# EAGLE design MICS-4514_CO_and_NOx_Sensor_Breakout (EAGLE 6.5.0)
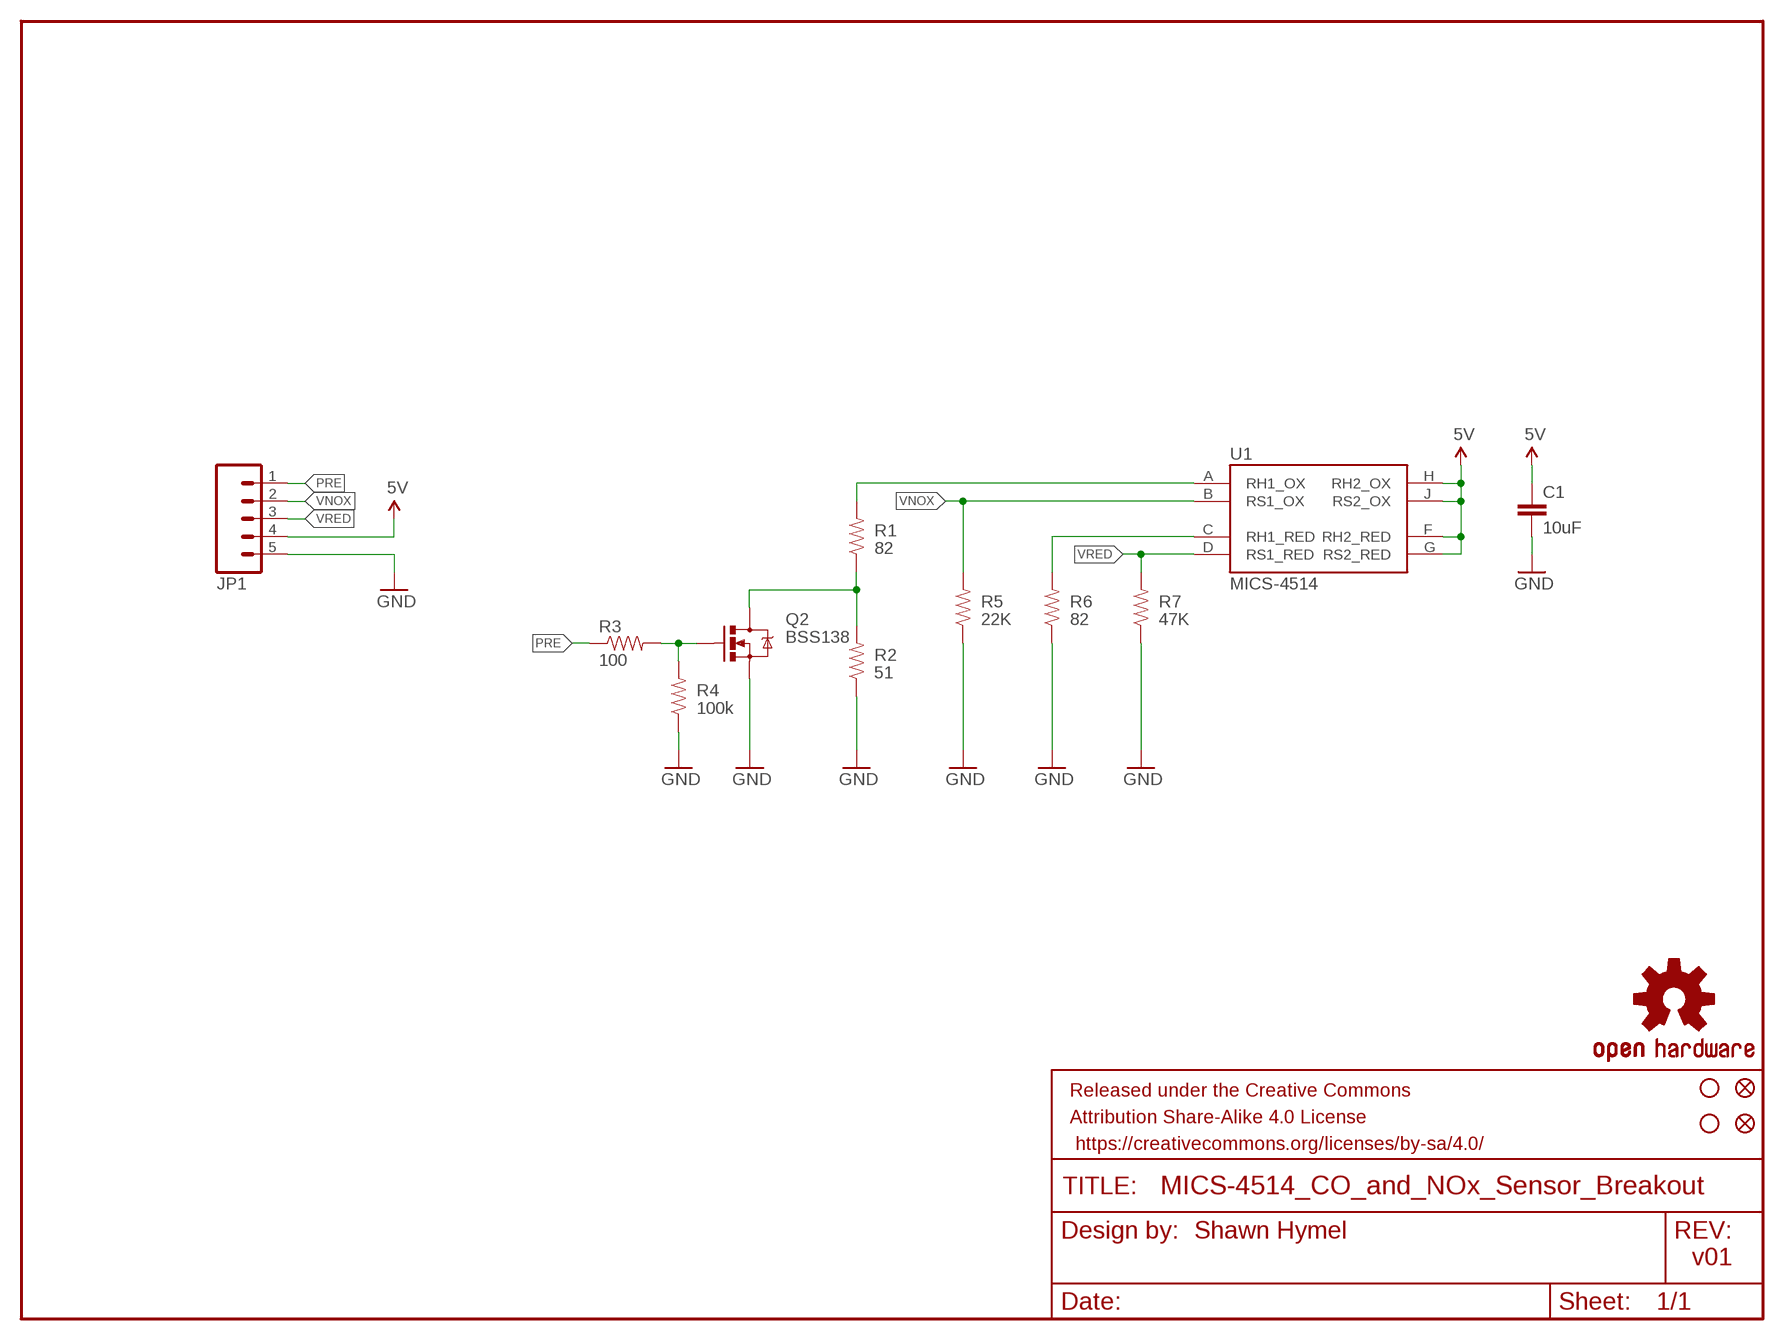
[diagram p0: schematic, sheet 1]

## Parts
C1  10uF  CAP0805  [0805]
FID1  FIDUCIAL1X2  [FIDUCIAL-1X2]
FID2  FIDUCIAL1X2  [FIDUCIAL-1X2]
FRAME1  FRAME-LETTER  [CREATIVE_COMMONS]
JP1  M05LOCK  [1X05_LOCK]
LOGO1  OSHW-LOGOS  [OSHW-LOGO-S]
Q2  MOSFET-NCHANNELBSS138  [SOT23-3]
R1  82  RESISTOR0805-RES  [0805]
R2  51  RESISTOR0603  [0603-RES]
R3  100  100OHM1/10W1%(0603)  [0603-RES]
R4  100k  100KOHM1/10W1%(0603)  [0603-RES]
R5  22K  22KOHM1/10W1%(0603)  [0603-RES]
R6  82  RESISTOR0805-RES  [0805]
R7  47K  47KOHM1/10W1%(0603)  [0603-RES]
STANDOFF3  STAND-OFF  [STAND-OFF]
STANDOFF5  STAND-OFF  [STAND-OFF]
U1  MICS-4514  [MICS_10-SMD]

## Nets
5V: C1.1 JP1.4 U1.F(RH2_RED) U1.G(RS2_RED) U1.H(RH2_OX) U1.J(RS2_OX)
GND: C1.2 JP1.5 Q2.2(S) R2.1 R4.1 R5.1 R6.1 R7.1
N$1: R1.2 U1.A(RH1_OX)
N$2: R6.2 U1.C(RH1_RED)
N$3: Q2.1(G) R3.2 R4.2
N$6: Q2.3(D) R1.1 R2.2
PRE: JP1.1 R3.1
VNOX: JP1.2 R5.2 U1.B(RS1_OX)
VRED: JP1.3 R7.2 U1.D(RS1_RED)

## Notes on the sheet
- Shawn Hymel
- v01

## Library data of the parts
C1 = SparkFun-Capacitors:CAP: Capacitor Standard 0603 ceramic capacitor, and 0.1" leaded capacitor.; PROD_ID: CAP-11330
FID1 FID2 = SparkFun-Aesthetics:FIDUCIAL: Fiducial Alignment Points Various fiducial points for machine vision alignment.
FRAME1 = SparkFun-Aesthetics:FRAME-LETTER: Schematic Frame Standard 8.5x11 US Letter frame
JP1 = SparkFun-Connectors:M05: Header 5 Standard 5-pin 0.1" header. Use with straight break away headers (SKU : PRT-00116), right angle break away headers (PRT-00553), swiss pins (PRT-00743), machine pins (PRT-00117), and female headers (PRT-00115). Molex polarized connector foot print use with SKU : PRT-08230 with associated crimp pins and housings.
LOGO1 = SparkFun-Aesthetics:OSHW-LOGO: Open Source Hardware Logo This logo indicates the piece of hardware it is found on incorporates a OSHW license and/or adheres to the definition of open source hardware found here: http://freedomdefined.org/OSHW
Q2 = SparkFun-DiscreteSemi:MOSFET-NCHANNEL: Common NMOSFET Parts MFG P/N Store ID Prod ID FDD8780 TRANS-09984 SI7820DN TRANS-11055 FDS6630A IC-08089 2N7002PW TRANS-11151 FQP30N06L COM-10213 TRANS-10060 BSS123LT1G TRANS-08345 BSS138 TRANS-00830 BS170 2N7000; PROD_ID: TRANS-00830; P_NAME: BSS138
R1 R6 = SparkFun-Resistors:RESISTOR: Resistor Basic schematic elements and footprints for 0603, 1206, and PTH resistors.; DK_ID: 541-82.0CCT-ND
R2 = SparkFun-Resistors:RESISTOR: Resistor Basic schematic elements and footprints for 0603, 1206, and PTH resistors.; PROD_ID: RES-12314
R3 = SparkFun-Resistors:100OHM1/10W1%(0603): RES-07863; PROD_ID: RES-07863
R4 = SparkFun-Resistors:100KOHM1/10W1%(0603): RES-07828; PROD_ID: RES-07828
R5 = SparkFun-Resistors:22KOHM1/10W1%(0603): RES-07853; PROD_ID: RES-07853
R7 = SparkFun-Resistors:47KOHM1/10W1%(0603): RES-07871; PROD_ID: RES-07871
STANDOFF3 STANDOFF5 = SparkFun-Electromechanical:STAND-OFF: #4 Stand Off This is the mechanical footprint for a #4 phillips button head screw. Use the keepout ring to avoid running the screw head into surrounding components. SKU : PRT-00447
U1 = SparkFun-Sensors:MICS-4514: Metal oxide MEMS carbon monoxide (CO) and NOx sensor in an SMD package.; PROD_ID: COMP-12310

## Board
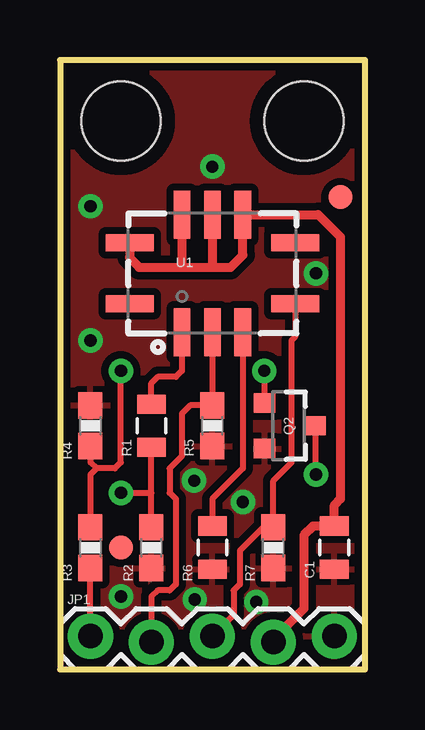
[diagram p1: board, top side]
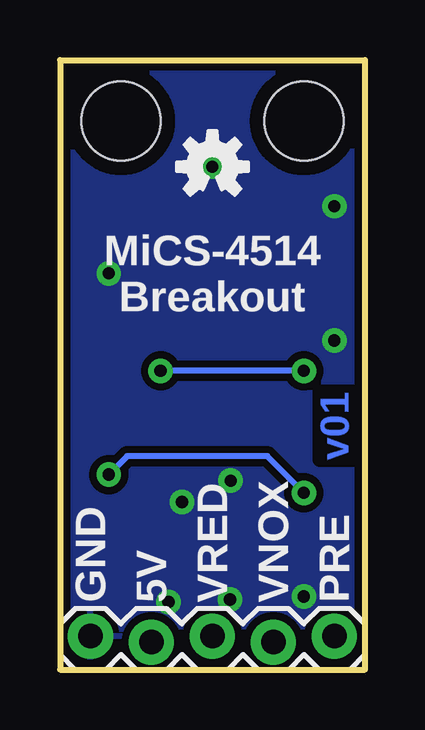
[diagram p2: board, bottom side, seen from below]

Size 12.7 x 25.4 mm. Coordinates in mm from the lower left corner, seen from the top.
Outline: 0,25.4 0,0 12.7,0 12.7,25.4 0,25.4
Copper layers (1*16): Top 0.035mm / dielectric 1.5mm / Bottom 0.035mm
Design rules "SparkFun-2-layer": minimum track width 7mil, minimum drill 15mil, track to track 8mil, track to pad 8mil, pad to pad 8mil, via to via 8mil, smd to smd 8mil, copper to edge 8mil, drill to drill 8mil, minimum pad ring 12mil, minimum via ring 10mil, stop-mask expansion 4mil, vias tented up to drill 20mil, thermal gap 10mil

### Footprints (pad centres in the part's own frame; a part is rotated, then mirrored left to right if it is on the bottom)
0805 = smd 0.8 x 1.2: 1 -0.9,0; 2 0.9,0
FIDUCIAL-1X2 = smd 1 x 1: 1 0,0
1X05_LOCK = drill 1.016 pad 1.88: 1 0,0.127; 2 2.54,-0.127; 3 5.08,0.127; 4 7.62,-0.127; 5 10.16,0.127
SOT23-3 = smd 0.8 x 0.9: 1 -0.95,-1; 2 0.95,-1; 3 0,1.1
0603-RES = smd 1.1 x 1: 1 -0.85,0; 2 0.85,0
STAND-OFF = hole 3.302: 0,0
MICS_10-SMD = smd 0.7 x 2: A 1.27,2.45; B 0,2.45; C -1.27,2.45; F -1.27,-2.45; G 0,-2.45; H 1.27,-2.45 | smd 2 x 0.7: D -3.45,1.27; E -3.45,-1.27; J 3.45,-1.27; K 3.45,1.27

### Placement (x,y rotation side)
C1  11.43,5.08 270 top
FID1  11.68,19.68 0 top
FID2  2.54,5.08 0 top
FRAME1  -15.24,-8.89 0 top  (outside the outline)
JP1  1.27,1.27 0 top
LOGO1  6.35,20.95 0 bottom
Q2  9.53,10.16 270 top
R1  3.81,10.16 90 top
R2  3.81,5.08 90 top
R3  1.27,5.08 90 top
R4  1.27,10.16 270 top
R5  6.35,10.16 90 top
R6  6.35,5.08 90 top
R7  8.89,5.08 90 top
STANDOFF3  10.16,22.86 0 top
STANDOFF5  2.54,22.86 0 top
U1  6.35,16.51 180 top

### Tracks (layer width: path | path; a pad name or v marks a point on that pad's centre or on a via)
5V
  Top 0.381: U1.J 2.9,17.17 3.3,16.76 5.08,16.76 | 5.08,16.76 6.35,16.76 | 6.35,16.76 7.11,16.76 7.62,17.27 U1.F 10.76,18.96 11.68,18.03 11.68,7.11 11.43,6.86 C1.1 10.55,5.98 10.16,5.59 10.16,2.54 8.89,1.27 JP1.4 | U1.G 6.35,16.76 | U1.H 5.08,16.76
GND  (via drill 0.51)
  other vias: 1.27,13.72 7.62,6.99 5.59,7.87 2.54,3.05 5.61,2.92 8.18,2.82 10.67,16.51 1.27,19.3 6.35,20.95
  pour Top (isolate 0.305): 0,0 0,25.4 12.7,25.4 12.7,0
  pour Bottom (isolate 0.305): 0,0 0,25.4 12.7,25.4 12.7,0
N$1
  Top 0.254: R1.2 3.81,11.94 4.06,12.19 4.83,12.19 5.08,12.45 U1.A
N$2
  Top 0.254: U1.C 7.62,8.38 6.35,7.11 R6.2
N$3  (via drill 0.51)
  Top 0.254: 1.52,8.38 2.29,8.38 2.54,8.64 v2.54,12.45 | 1.52,8.38 1.27,8.13 R3.2 | Q2.1 8.53,12.43 v8.51,12.45 | R4.2 1.27,8.64 1.52,8.38
  Bottom 0.254: v2.54,12.45 v8.51,12.45
N$6  (via drill 0.51)
  Top 0.254: R2.2 3.81,7.37 | 3.81,7.37 R1.1 | v2.54,7.37 3.81,7.37 | Q2.3 10.62,8.17 v10.67,8.13
  Bottom 0.254: v2.54,7.37 4.06,8.89 9.91,8.89 v10.67,8.13
PRE
  Top 0.254: JP1.1 R3.1
VNOX
  Top 0.254: 3.81,1.27 JP1.2 3.81,3.05 4.06,3.3 4.57,3.3 4.83,3.56 4.83,7.11 4.57,7.37 4.57,8.38 5.08,8.89 5.08,10.67 5.42,11.01 R5.2 U1.B
VRED
  Top 0.254: U1.D 9.8,13.86 9.65,13.72 9.65,8.64 8.89,7.87 R7.2 8.47,5.93 7.49,4.95 7.49,3.56 7.24,3.3 7.24,2.29 JP1.3

### Text on the board
Bottom: v01
bPlace: MiCS-4514 / Breakout | PRE | VNOX | VRED | 5V | GND
tDocu: Shawn Hymel